# Altium project AM3358_DEV_BOARD.PrjPcb (part 2 of 3)

## Sheet 07. WIFI.SchDoc
size A2
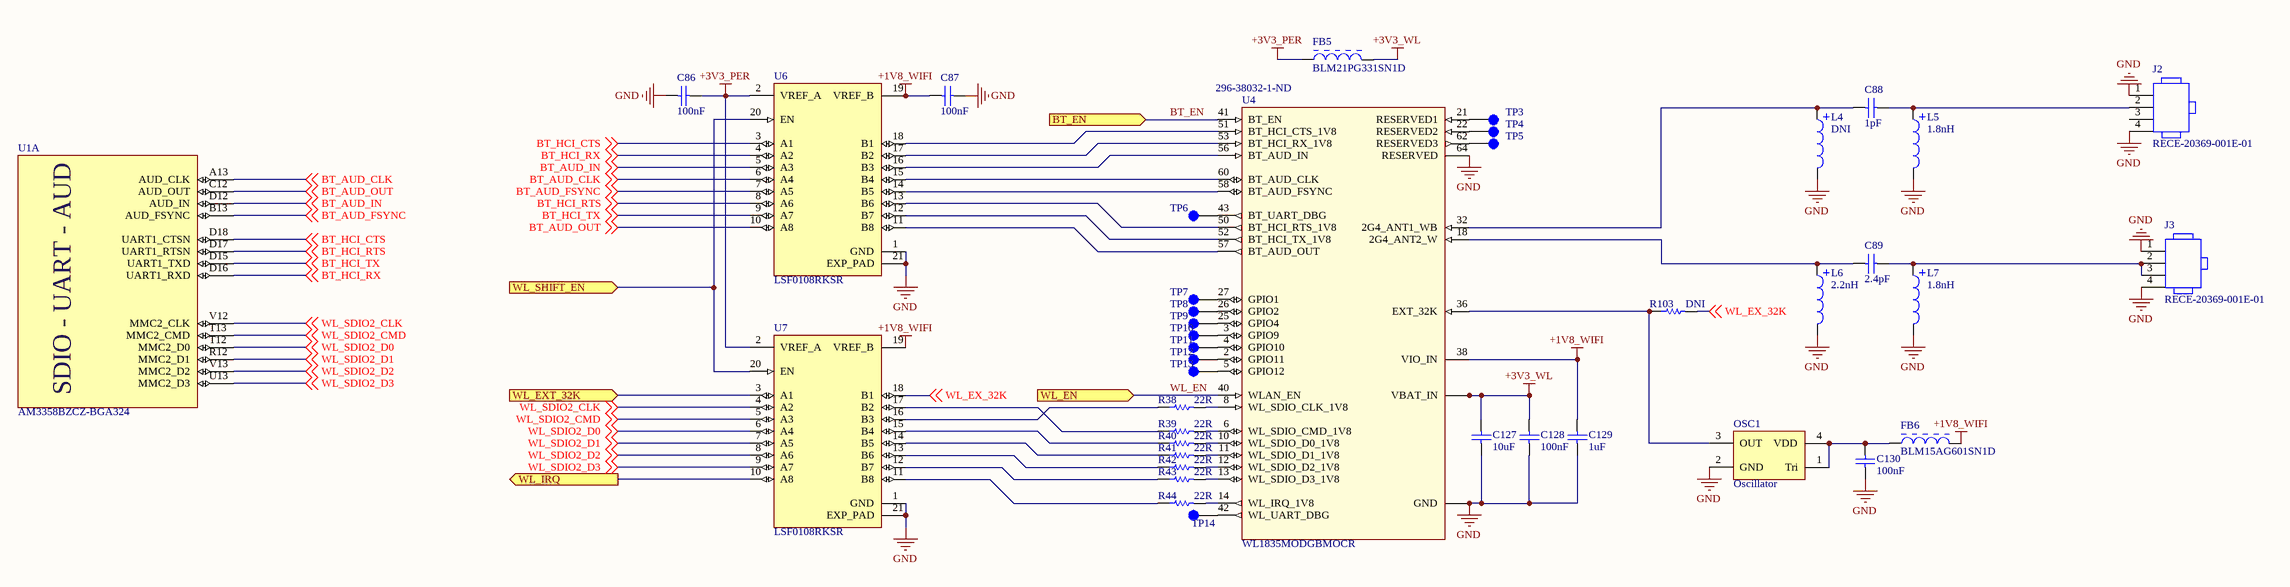
[diagram p4: 07. WIFI.SchDoc]

### Parts
C86  100nF  [CAPC1005X60X30LL05T10]
C87  100nF  [CAPC1005X60X30LL05T10]
C88  1pF  [CAPC1005X60X30LL05T10]
C89  2.4pF  [CAPC1005X60X30LL05T10]
C127  10uF  [CAPC1608X90X35ML10T15]
C128  100nF  [CAPC1005X60X30LL05T10]
C129  1uF  [CAPC0402(1005)60_M]
C130  100nF  [CAPC1005X60X30LL05T10]
FB5  BLM21PG331SN1D  [MURA-BLM21-H1-CHIP-2_V]
FB6  BLM15AG601SN1D  [MURA-BLM15-CHIP-2_V]
J2  RECE-20369-001E-01  [TG-RECE-20369-001E-4_V]
J3  RECE-20369-001E-01  [TG-RECE-20369-001E-4_V]
L4  DNI  [INDC1005X55X25ML5T10]
L5  1.8nH  [INDC1005X55X25ML5T10]
L6  2.2nH  [INDC1005X55X25ML5T10]
L7  1.8nH  [INDC1005X55X25ML5T10]
OSC1  Oscillator  [FP-NX3225SA-MFG]
R38  22R  [RESC1005X40X25LL05T05]
R39  22R  [RESC1005X40X25LL05T05]
R40  22R  [RESC1005X40X25LL05T05]
R41  22R  [RESC1005X40X25LL05T05]
R42  22R  [RESC1005X40X25LL05T05]
R43  22R  [RESC1005X40X25LL05T05]
R44  22R  [RESC1005X40X25LL05T05]
R103  DNI  [RESC1005X40X25LL05T05]
TP3  Test Point  [TP]  (value not drawn)
TP4  Test Point  [TP]  (value not drawn)
TP5  Test Point  [TP]  (value not drawn)
TP6  Test Point  [TP]  (value not drawn)
TP7  Test Point  [TP]  (value not drawn)
TP8  Test Point  [TP]  (value not drawn)
TP9  Test Point  [TP]  (value not drawn)
TP10  Test Point  [TP]  (value not drawn)
TP11  Test Point  [TP]  (value not drawn)
TP12  Test Point  [TP]  (value not drawn)
TP13  Test Point  [TP]  (value not drawn)
TP14  Test Point  [TP]  (value not drawn)
U1  AM3358BZCZ-BGA324  [TI-ZCZ324]  (part A of 11)
U4  WL1835MODGBMOCR  Supplier Part Number 1: 296-38032-1-ND  [WL1835MODGBMOCR]
U6  LSF0108RKSR  [QFN50P450X250X100-21N]
U7  LSF0108RKSR  [QFN50P450X250X100-21N]

### Ports
BT_EN (in), WL_EN (in), WL_EXT_32K (in), WL_IRQ (out), WL_SHIFT_EN (in)

### Nets
+1V8_WIFI: C87.2 C129.1 FB6.2 U4.38(VIO_IN) U6.19(VREF_B) U7.19(VREF_B)
+3V3_PER: C86.2 FB5.1 U6.2(VREF_A) U7.2(VREF_A)
+3V3_WL: C127.2 C128.2 FB5.2 U4.46(VBAT_IN) U4.47(VBAT_IN)
GND: C86.1 C87.1 C127.1 C128.1 C129.2 C130.1 J2.1 J2.4 J3.1 J3.4 L4.2 L5.2 L6.2 L7.2 OSC1.2(GND) U4.1(GND) U4.7(GND) U4.9(GND) U4.15(GND) U4.16(GND) U4.17(GND) U4.19(GND) U4.20(GND) U4.23(GND) U4.24(GND) U4.28(GND) U4.29(GND) U4.30(GND) U4.31(GND) U4.33(GND) U4.34(GND) U4.35(GND) U4.37(GND) U4.39(GND) U4.44(GND) U4.45(GND) U4.48(GND) U4.49(GND) U4.54(GND) U4.55(GND) U4.59(GND) U4.61(GND) U4.63(GND) U4.64(RESERVED) U4.G1(GND) U4.G2(GND) U4.G3(GND) U4.G4(GND) U4.G5(GND) U4.G6(GND) U4.G7(GND) U4.G8(GND) U4.G9(GND) U4.G10(GND) U4.G11(GND) U4.G12(GND) U4.G13(GND) U4.G14(GND) U4.G15(GND) U4.G16(GND) U4.G17(GND) U4.G18(GND) U4.G19(GND) U4.G20(GND) U4.G21(GND) U4.G22(GND) U4.G23(GND) U4.G24(GND) U4.G25(GND) U4.G26(GND) U4.G27(GND) U4.G28(GND) U4.G29(GND) U4.G30(GND) U4.G31(GND) U4.G32(GND) U4.G33(GND) U4.G34(GND) U4.G35(GND) U4.G36(GND) U6.1(GND) U6.21(EXP_PAD) U7.1(GND) U7.21(EXP_PAD)
BT_AUD_CLK: U1.A13(AUD_CLK) U6.6(A4) ; off-sheet BT_AUD_CLK
BT_AUD_FSYNC: U1.B13(AUD_FSYNC) U6.7(A5) ; off-sheet BT_AUD_FSYNC
BT_AUD_IN: U1.D12(AUD_IN) U6.5(A3) ; off-sheet BT_AUD_IN
BT_AUD_OUT: U1.C12(AUD_OUT) U6.10(A8) ; off-sheet BT_AUD_OUT
BT_EN: U4.41(BT_EN) ; port BT_EN
BT_HCI_CTS: U1.D18(UART1_CTSN) U6.3(A1) ; off-sheet BT_HCI_CTS
BT_HCI_RTS: U1.D17(UART1_RTSN) U6.8(A6) ; off-sheet BT_HCI_RTS
BT_HCI_RX: U1.D16(UART1_RXD) U6.4(A2) ; off-sheet BT_HCI_RX
BT_HCI_TX: U1.D15(UART1_TXD) U6.9(A7) ; off-sheet BT_HCI_TX
JTAG_EMU3: U7.3(A1) ; port WL_EXT_32K
WL_EN: U4.40(WLAN_EN) ; port WL_EN
WL_EX_32K: R103.2 U7.18(B1) ; off-sheet WL_EX_32K
WL_SDIO2_CLK: U1.V12(MMC2_CLK) U7.4(A2) ; off-sheet WL_SDIO2_CLK
WL_SDIO2_CMD: U1.T13(MMC2_CMD) U7.5(A3) ; off-sheet WL_SDIO2_CMD
WL_SDIO2_D0: U1.T12(MMC2_D0) U7.6(A4) ; off-sheet WL_SDIO2_D0
WL_SDIO2_D1: U1.R12(MMC2_D1) U7.7(A5) ; off-sheet WL_SDIO2_D1
WL_SDIO2_D2: U1.V13(MMC2_D2) U7.8(A6) ; off-sheet WL_SDIO2_D2
WL_SDIO2_D3: U1.U13(MMC2_D3) U7.9(A7) ; off-sheet WL_SDIO2_D3
NetC88_1: C88.1 L4.1 U4.32(2G4_ANT1_WB)
NetC88_2: C88.2 J2.2 L5.1
NetC89_1: C89.1 L6.1 U4.18(2G4_ANT2_W)
NetC89_2: C89.2 J3.2 J3.3 L7.1
NetC130_2: C130.2 FB6.1 OSC1.1(Tri) OSC1.4(VDD)
NetOSC1_3: OSC1.3(OUT) R103.1 U4.36(EXT_32K)
NetR38_1: R38.1 U7.16(B3)
NetR38_2: R38.2 U4.8(WL_SDIO_CLK_1V8)
NetR39_1: R39.1 U7.17(B2)
NetR39_2: R39.2 U4.6(WL_SDIO_CMD_1V8)
NetR40_1: R40.1 U7.15(B4)
NetR40_2: R40.2 U4.10(WL_SDIO_D0_1V8)
NetR41_1: R41.1 U7.14(B5)
NetR41_2: R41.2 U4.11(WL_SDIO_D1_1V8)
NetR42_1: R42.1 U7.13(B6)
NetR42_2: R42.2 U4.12(WL_SDIO_D2_1V8)
NetR43_1: R43.1 U7.12(B7)
NetR43_2: R43.2 U4.13(WL_SDIO_D3_1V8)
NetR44_1: R44.1 U7.11(B8)
NetR44_2: R44.2 U4.14(WL_IRQ_1V8)
NetTP3_1: TP3.1 U4.21(RESERVED1)
NetTP4_1: TP4.1 U4.22(RESERVED2)
NetTP5_1: TP5.1 U4.62(RESERVED3)
NetTP6_1: TP6.1 U4.43(BT_UART_DBG)
NetTP7_1: TP7.1 U4.27(GPIO1)
NetTP8_1: TP8.1 U4.26(GPIO2)
NetTP9_1: TP9.1 U4.25(GPIO4)
NetTP10_1: TP10.1 U4.3(GPIO9)
NetTP11_1: TP11.1 U4.4(GPIO10)
NetTP12_1: TP12.1 U4.2(GPIO11)
NetTP13_1: TP13.1 U4.5(GPIO12)
NetTP14_1: TP14.1 U4.42(WL_UART_DBG)
NetU1_B12: U7.10(A8) ; port WL_IRQ
NetU1_C13: U6.20(EN) U7.20(EN) ; port WL_SHIFT_EN
NetU4_50: U4.50(BT_HCI_RTS_1V8) U6.13(B6)
NetU4_51: U4.51(BT_HCI_CTS_1V8) U6.18(B1)
NetU4_52: U4.52(BT_HCI_TX_1V8) U6.12(B7)
NetU4_53: U4.53(BT_HCI_RX_1V8) U6.17(B2)
NetU4_56: U4.56(BT_AUD_IN) U6.16(B3)
NetU4_57: U4.57(BT_AUD_OUT) U6.11(B8)
NetU4_58: U4.58(BT_AUD_FSYNC) U6.14(B5)
NetU4_60: U4.60(BT_AUD_CLK) U6.15(B4)

Not connected (* = marked no-connect by the designer): J2 3

### Notes on the sheet
- Title
- Size:
- Date:
- Design by:
- A4
- Number:
- Time:
- Check by:
- Revision:
- Sheet
- of
- N.S.T
- https://github.com/tung080827
- (in symbol AM3358BZCZ100, part A) SDIO - UART - AUD

### Library data of the parts
C86 C87 C128 C130 = CMP-2100-03641-1: as C1 on sheet 03. POWER; REACH SVHC: NoSVHC; Depth: 0.5mm; Case/Package: 0402; Datasheet URL: http://psearch.en.murata.com/capacitor/product/GRM155R71C104KA88%23.pdf; Lead Free: LeadFree; Dielectric Material: Ceramic; Manufacturer URL: http://www.murata.com/; Min Operating Temperature: -55degC; Length: 1mm; Case Code (Metric): 1005; Radiation Hardening: No; Package Reference: 0402; RoHSCompliant: true; Datasheet Version: 42675.0; Thickness: 0.022inch; Packaging: TapeandReel; Voltage Rating (DC): 16V; Tolerance: 10%; Max Operating Temperature: 125degC; Package Description: 2-Pin Surface Mount Device, Body 1 x 0.5 mm; Mount: SurfaceMount; Height: 0.5mm; Width: 0.5mm; Number of Pins: 2; Voltage Rating: 16V; Case Code (Imperial): 0402; Termination: SMD/SMT; Capacitance: 100nF; Package Quantity: 1
C88 = CMP-2008-02599-1: Ceramic; Cap 1 pF; Tol 0.25 pF; Vol-Rtg 50 VDC; SMT; 0402; C0G; Tape & Reel; Part Number: 04025A1R0CAT2A; Manufacturer: AVX Interconnect / Elco
C89 = CMP-1032-00062-1: CAP 2.4pF 16V ±0.25pF 01005 (0402 Metric) Thickness 0.22mm SMD; Tolerance: Â±0.25pF; Case-Metric: 0402; Case-EIA: 01005; Technology: SMT; Value: 2.4pF; Rated Voltage: 16 V; Max Thickness: 0.22 mm
C127 = CMP-2006-02792-1: Chip Capacitor, 10 uF, +/- 10%, 6.3 V, -55 to 125 degC, 0603 (1608 Metric), RoHS, Tape and Reel; Part Number: GRM188R60J106ME47D; Manufacturer: Murata
C129 = CMP-1034-02113-1: CAP 1uF 6.3V ±10% 0402 (1005 Metric) Thickness 0.6mm SMD; Case-Metric: 1005; Case-EIA: 0402; Tolerance: Â±10%; Value: 1uF; Technology: SMT; Rated Voltage: 6.3 V; Max Thickness: 0.6 mm
FB5 = CMP-0686-00713-2: Chip Ferrite Bead for Power Lines, 330 Ohm, 1500 mA, -55 to 125 degC, 2 x 1.25 x 1.05 mm SMD, Tape and Reel; Manufacturer: Murata; Rated Current: 1500 mA; DC Resistance: 0.07 Ohm Max.; Impedance (at 100 MHz): 330 Ohm +/- 25%; Operating Temperature Range: -55 to 125 degC; PartNumber: BLM21PG331SN1D; ComponentLink2URL: http://www.murata.com/products/catalog/pdf/c31e.pdf; PackageDescription: 2-Pin Chip, Body 2 x 1.25 mm; PackageReference: BLM21_H1050-2; ComponentLink1Description: Manufacturer URL; ComponentLink2Description: Datasheet; ComponentLink3Description: Package Specification; ComponentLink3URL: http://www.murata.com/products/catalog/pdf/c31e.pdf; DatasheetVersion: 08/2013; ComponentLink1URL: http://www.murata.com/; Packing: Tape and Reel; Mounting Technology: Surface Mount
FB6 = CMP-0686-00187-3: Chip Ferrite Bead for General Use, 600 Ohm, 300 mA, -55 to 125 degC, 1 x 0.5 x 0.55 mm SMD, Tape and Reel; Manufacturer: Murata; Impedance (at 100 MHz): 600 Ohm +/- 25%; DC Resistance: 0.52 Ohm Max.; Rated Current: 300 mA; PackageDescription: 2-Pin Chip, Body 1 x 0.5 mm; Mounting Technology: Surface Mount; ComponentLink1Description: Manufacturer URL; ComponentLink3Description: Package Specification; ComponentLink2Description: Datasheet; Operating Temperature Range: -55 to 125 degC; Packing: Tape and Reel; ComponentLink1URL: http://www.murata.com/; PackageReference: BLM15-2; DatasheetVersion: 08/2013; PartNumber: BLM15AG601SN1D; ComponentLink3URL: http://www.murata.com/products/catalog/pdf/c31e.pdf; ComponentLink2URL: http://www.murata.com/products/catalog/pdf/c31e.pdf
J2 J3 = CMP-0275-00001-2: RF Connector, Onboard Receptacle, IPEX MHFIII; Manufacturer: Taoglas; Packing: Tape and Reel; Mounting Technology: Surface Mount; PackageReference: RECE-20369-001E-01-4; ComponentLink1URL: http://www.taoglas.com/; Housing Color: Gold; DatasheetVersion: Rev. C; ComponentLink2URL: http://www.taoglas.com/images/product_images/original_images/RECE.20369.001E.01.pdf; ComponentLink3Description: Package Specification; PackageVersion: Rev. C; ComponentLink1Description: Manufacturer URL; ComponentLink2Description: Datasheet; PackageDescription: 4-Pin, Hand Drawn, Body 1.7x1.7mm; ComponentLink3URL: http://www.taoglas.com/images/product_images/original_images/RECE.20369.001E.01.pdf; PartNumber: RECE-20369-001E-01
L4 L5 L7 = CMP-1662-00024-1: Chip Inductor, 1.8 nH, +/- 0.3 nH, 300 mA, -55 to 125 degC, 0402 (1005 Metric), RoHS, Tape and Reel; Voltage Rating: 50 V; Case\Package: 0603; Power Rating: 100 mW; Resistance: 47 Ohm; Tolerance: 1%; PackageDescription: 2-Pin Surface Mount Device, Body 1 x 0.5 mm; ComponentLink1Description: Manufacturer URL; Length: 1.6 mm; Case Code (Imperial): 0603; REACH SVHC: No SVHC; Case Code (Metric): 1608; ComponentLink1URL: http://www.murata.com/; DatasheetVersion: Sep-10; Height: 0.45 mm; ComponentLink2URL: http://search.murata.co.jp/Ceramy/image/img/PDF/ENG/L0075S0083LQG15HN.pdf; Packaging: Tape and Reel; PackageReference: 0402; Min Operating Temperature: -55 degC; Mount: Surface Mount; Package Quantity: 5000; Width: 0.8 mm; RoHSCompliant: true; Voltage Rating (DC): 50 V; Pins: 2; ComponentLink2Description: Datasheet; Max Operating Temperature: 155 degC
L6 = CMP-1662-00024-1: Chip Inductor, 2.2 nH, +/- 0.3 nH, 300 mA, -55 to 125 degC, 0402 (1005 Metric), RoHS, Tape and Reel; Voltage Rating: 50 V; Case\Package: 0603; Power Rating: 100 mW; Resistance: 47 Ohm; Tolerance: 1%; PackageDescription: 2-Pin Surface Mount Device, Body 1 x 0.5 mm; ComponentLink1Description: Manufacturer URL; Length: 1.6 mm; Case Code (Imperial): 0603; REACH SVHC: No SVHC; Case Code (Metric): 1608; ComponentLink1URL: http://www.murata.com/; DatasheetVersion: Sep-10; Height: 0.45 mm; ComponentLink2URL: http://search.murata.co.jp/Ceramy/image/img/PDF/ENG/L0075S0083LQG15HN.pdf; Packaging: Tape and Reel; PackageReference: 0402; Min Operating Temperature: -55 degC; Mount: Surface Mount; Package Quantity: 5000; Width: 0.8 mm; RoHSCompliant: true; Voltage Rating (DC): 50 V; Pins: 2; ComponentLink2Description: Datasheet; Max Operating Temperature: 155 degC
R38-R44 R103 = CMP-1665-00027-3: as R77 on sheet 05. LCD; ComponentLink2Description: Datasheet; Packaging: Tape and Reel; Weight: 2.8E-05oz; Pins: 2; Case Code (Imperial): 0402; Width: 0.5 mm; ComponentLink2URL: http://industrial.panasonic.com/cdbs/www-data/pdf/RDA0000/AOA0000C86.pdf; Height: 0.35 mm; PackageReference: 0402; REACH SVHC: Yes; Min Operating Temperature: -55 degC; Length: 1 mm; DatasheetVersion: 04/2015; RoHSCompliant: true; Package Quantity: 10000; Case Code (Metric): 1005; PackageDescription: 2-Pin Surface Mount Device, Body 1 x 0.5 mm; ComponentLink1URL: http://www.panasonic.com/; Mount: Surface Mount; Mounting Technology: Surface Mount; Tolerance: 1%; Max Operating Temperature: 155 degC; ComponentLink1Description: Manufacturer URL
TP3-TP14 = TP
U1 = AM3358BZCZ100: as U1 on sheet 03. POWER; Supplier 1: Digi-Key
U4 = WL1835MOD: Bluetooth, WiFi 802.11b/g/n, Bluetooth 4.2 Transceiver Module 2.4GHz Surface Mount; Supplier 1: Digi-Key
U6 U7 = LSF0108: Voltage Level Translator Bidirectional 1 Circuit 8 Channel 20-VQFN _4.5x2.5_; MF: Texas Instruments; Value: *; MP: LSF0108RKSR; Package: VQFN-20 Texas Instruments; Price: None; Availability: Unavailable; SnapEDA_Link: https://www.snapeda.com/parts/LSF0108RKSR/Texas%20Instruments/view-part/190982/?ref=snap
OSC1 = Oscillator: Supplier 1: Digi-Key

## Sheet 09. SDIO, PERIPHERAL.SchDoc
size A3
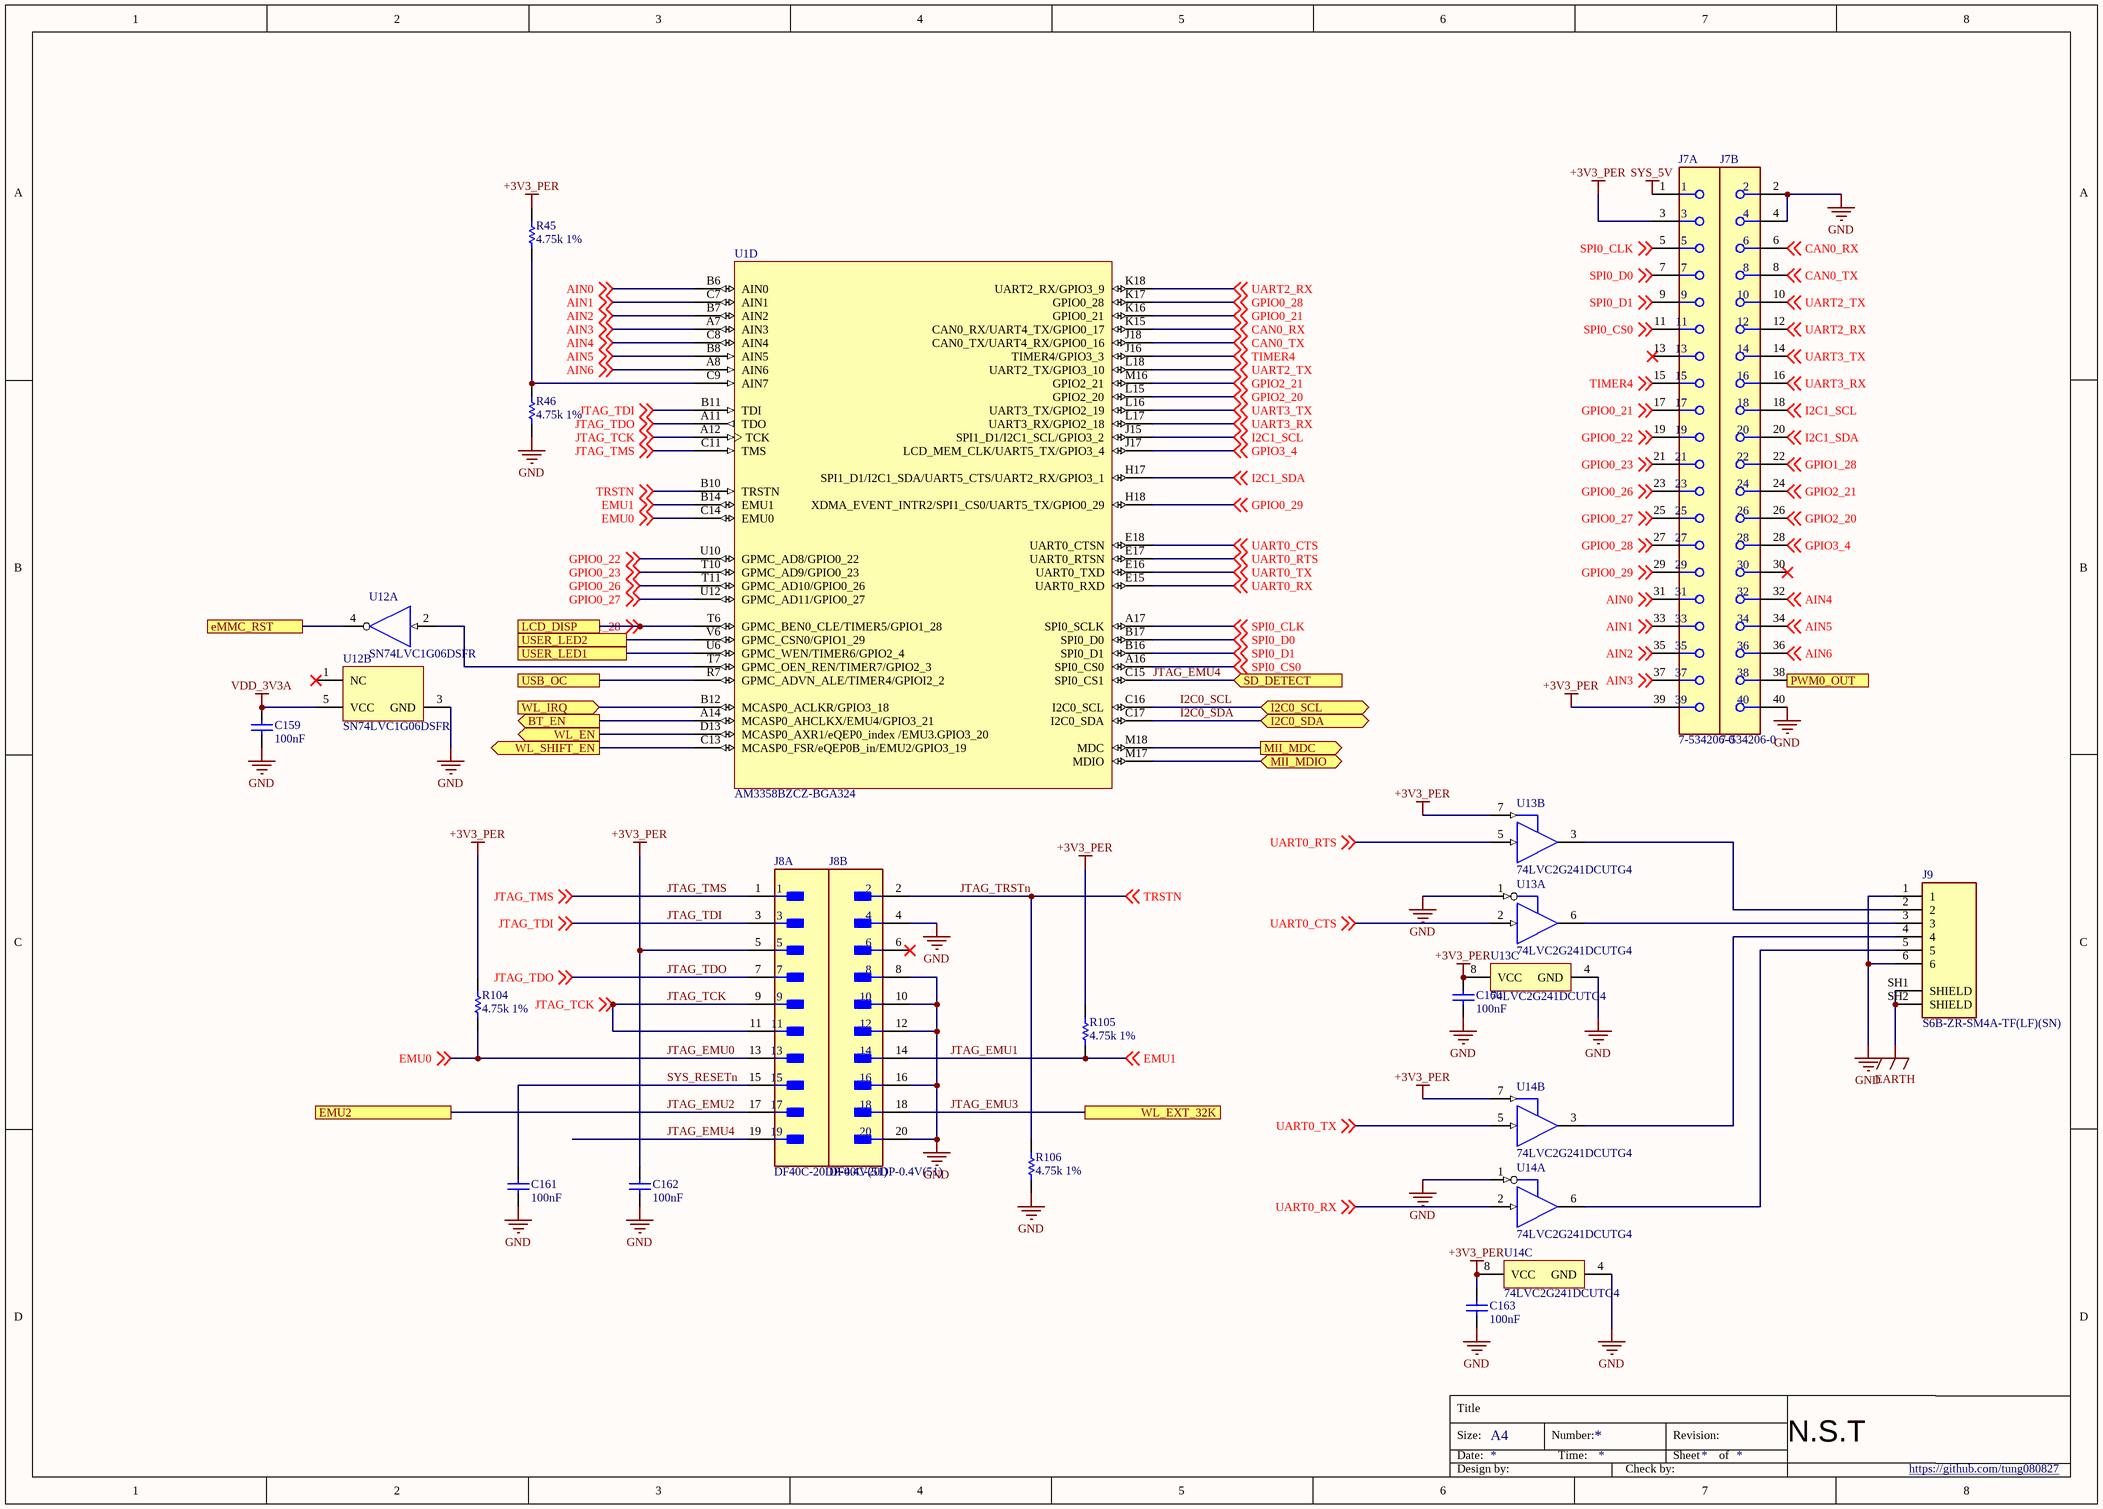
[diagram p5: 09. SDIO, PERIPHERAL.SchDoc]

### Parts
C159  100nF  [CAPC1005X55X25LL05T10]
C160  100nF  [CAPC1005X55X25LL05T10]
C161  100nF  [CAPC1005X55X25LL05T10]
C162  100nF  [CAPC1005X55X25LL05T10]
C163  100nF  [CAPC1005X55X25LL05T10]
J7  7-534206-0  [FP-7-534206-0-MFG]  (parts A,B of 2)
J8  DF40C-20DP-0.4V(51)  [FP-DF40C-20DP-0_4V_51-MFG]  (parts A,B of 3)
J9  S6B-ZR-SM4A-TF(LF)(SN)  [JST_S6B-ZR-SM4A-TF]
R45  4.75k 1%  [RESC1005X40X25LL05T05]
R46  4.75k 1%  [RESC1005X40X25LL05T05]
R104  4.75k 1%  [RESC1005X40X25LL05T05]
R105  4.75k 1%  [RESC1005X40X25LL05T05]
R106  4.75k 1%  [RESC1005X40X25LL05T05]
U1  AM3358BZCZ-BGA324  [TI-ZCZ324]  (part D of 11)
U12  SN74LVC1G06DSFR  [DSF0006A_V]  (parts A,B of 2)
U13  74LVC2G241DCUTG4  [DCU0008A_M]  (parts A,B,C of 3)
U14  74LVC2G241DCUTG4  [DCU0008A_M]  (parts A,B,C of 3)

### Ports
BT_EN (out), eMMC_RST, EMU2, I2C0_SCL (bidir), I2C0_SDA (bidir), LCD_DISP, MII_MDC (out), MII_MDIO (bidir), PWM0_OUT, SD_DETECT (in), USB_OC, USER_LED1, USER_LED2, WL_EN (out), WL_EXT_32K, WL_IRQ (in), WL_SHIFT_EN (out)

### Nets
+3V3_PER: C160.2 C162.2 C163.2 J7.3 J7.39 J8.5 R45.2 R104.2 R105.2 U13.7(2OE) U13.8(VCC) U14.7(2OE) U14.8(VCC)
EARTH: J9.SH1(SHIELD) J9.SH2(SHIELD)
GND: C159.1 C160.1 C161.1 C162.1 C163.1 J7.2 J7.4 J7.40 J8.4 J8.8 J8.10 J8.12 J8.16 J8.20 J9.1 J9.6 R46.1 R106.1 U12.3(GND) U13.1(1~{OE}) U13.4(GND) U14.1(1~{OE}) U14.4(GND)
SYS_5V: J7.1
VDD_3V3A: C159.2 U12.5(VCC)
AIN0: J7.31 U1.B6(AIN0) ; off-sheet AIN0
AIN1: J7.33 U1.C7(AIN1) ; off-sheet AIN1
AIN2: J7.35 U1.B7(AIN2) ; off-sheet AIN2
AIN3: J7.37 U1.A7(AIN3) ; off-sheet AIN3
AIN4: J7.32 U1.C8(AIN4) ; off-sheet AIN4
AIN5: J7.34 U1.B8(AIN5) ; off-sheet AIN5
AIN6: J7.36 U1.A8(AIN6) ; off-sheet AIN6
BT_EN: U1.A14(MCASP0_AHCLKX/EMU4/GPIO3_21) ; port BT_EN
CAN0_RX: J7.6 U1.K15(CAN0_RX/UART4_TX/GPIO0_17) ; off-sheet CAN0_RX
CAN0_TX: J7.8 U1.J18(CAN0_TX/UART4_RX/GPIO0_16) ; off-sheet CAN0_TX
GPIO0_21: J7.17 U1.K16(GPIO0_21) ; off-sheet GPIO0_21
GPIO0_22: J7.19 U1.U10(GPMC_AD8/GPIO0_22) ; off-sheet GPIO0_22
GPIO0_23: J7.21 U1.T10(GPMC_AD9/GPIO0_23) ; off-sheet GPIO0_23
GPIO0_26: J7.23 U1.T11(GPMC_AD10/GPIO0_26) ; off-sheet GPIO0_26
GPIO0_27: J7.25 U1.U12(GPMC_AD11/GPIO0_27) ; off-sheet GPIO0_27
GPIO0_28: J7.27 U1.K17(GPIO0_28) ; off-sheet GPIO0_28
GPIO0_29: J7.29 U1.H18(XDMA_EVENT_INTR2/SPI1_CS0/UART5_TX/GPIO0_29) ; off-sheet GPIO0_29
GPIO1_28: J7.22 U1.T6(GPMC_BEN0_CLE/TIMER5/GPIO1_28) ; off-sheet GPIO1_28, port LCD_DISP
GPIO2_20: J7.26 U1.L15(GPIO2_20) ; off-sheet GPIO2_20
GPIO2_21: J7.24 U1.M16(GPIO2_21) ; off-sheet GPIO2_21
GPIO3_4: J7.28 U1.J17(LCD_MEM_CLK/UART5_TX/GPIO3_4) ; off-sheet GPIO3_4
I2C0_SCL: U1.C16(I2C0_SCL) ; port I2C0_SCL
I2C0_SDA: U1.C17(I2C0_SDA) ; port I2C0_SDA
I2C1_SCL: J7.18 U1.J15(SPI1_D1/I2C1_SCL/GPIO3_2) ; off-sheet I2C1_SCL
I2C1_SDA: J7.20 U1.H17(SPI1_D1/I2C1_SDA/UART5_CTS/UART2_RX/GPIO3_1) ; off-sheet I2C1_SDA
JTAG_EMU0: J8.13 R104.1 U1.C14(EMU0) ; off-sheet EMU0  [also labelled EMU0]
JTAG_EMU1: J8.14 R105.1 U1.B14(EMU1) ; off-sheet EMU1  [also labelled EMU1]
JTAG_EMU2: J8.17 ; port EMU2
JTAG_EMU3: J8.18 ; port WL_EXT_32K
JTAG_EMU4: J8.19 U1.C15(SPI0_CS1) ; port SD_DETECT
JTAG_TCK: J8.9 J8.11 U1.A12(TCK) ; off-sheet JTAG_TCK
JTAG_TDI: J8.3 U1.B11(TDI) ; off-sheet JTAG_TDI
JTAG_TDO: J8.7 U1.A11(TDO) ; off-sheet JTAG_TDO
JTAG_TMS: J8.1 U1.C11(TMS) ; off-sheet JTAG_TMS
JTAG_TRSTn: J8.2 R106.2 U1.B10(TRSTN) ; off-sheet TRSTN  [also labelled TRSTN]
SPI0_CLK: J7.5 U1.A17(SPI0_SCLK) ; off-sheet SPI0_CLK
SPI0_CS0: J7.11 U1.A16(SPI0_CS0) ; off-sheet SPI0_CS0
SPI0_D0: J7.7 U1.B17(SPI0_D0) ; off-sheet SPI0_D0
SPI0_D1: J7.9 U1.B16(SPI0_D1) ; off-sheet SPI0_D1
SYS_RESETn: C161.2 J8.15
TIMER4: J7.15 U1.J16(TIMER4/GPIO3_3) ; off-sheet TIMER4
UART0_CTS: U1.E18(UART0_CTSN) U13.2(1A) ; off-sheet UART0_CTS
UART0_RTS: U1.E17(UART0_RTSN) U13.5(2A) ; off-sheet UART0_RTS
UART0_RX: U1.E15(UART0_RXD) U14.2(1A) ; off-sheet UART0_RX
UART0_TX: U1.E16(UART0_TXD) U14.5(2A) ; off-sheet UART0_TX
UART2_RX: J7.12 U1.K18(UART2_RX/GPIO3_9) ; off-sheet UART2_RX
UART2_TX: J7.10 U1.L18(UART2_TX/GPIO3_10) ; off-sheet UART2_TX
UART3_RX: J7.16 U1.L17(UART3_RX/GPIO2_18) ; off-sheet UART3_RX
UART3_TX: J7.14 U1.L16(UART3_TX/GPIO2_19) ; off-sheet UART3_TX
WL_EN: U1.D13(MCASP0_AXR1/eQEP0_index_/EMU3.GPIO3_20) ; port WL_EN
NetJ7_38: J7.38 ; port PWM0_OUT
NetJ9_2: J9.2 U13.3(2Y)
NetJ9_3: J9.3 U13.6(1Y)
NetJ9_4: J9.4 U14.3(2Y)
NetJ9_5: J9.5 U14.6(1Y)
NetR36_2: U1.M17(MDIO) ; port MII_MDIO
NetR45_1: R45.1 R46.2 U1.C9(AIN7)
NetR62_1: U12.4(Y) ; port eMMC_RST
NetR107_1: U1.R7(GPMC_ADVN_ALE/TIMER4/GPIOI2_2) ; port USB_OC
NetU1_B12: U1.B12(MCASP0_ACLKR/GPIO3_18) ; port WL_IRQ
NetU1_C13: U1.C13(MCASP0_FSR/eQEP0B_in/EMU2/GPIO3_19) ; port WL_SHIFT_EN
NetU1_M18: U1.M18(MDC) ; port MII_MDC
NetU1_T7: U1.T7(GPMC_OEN_REN/TIMER7/GPIO2_3) U12.2(A)
NetU1_U6: U1.U6(GPMC_WEN/TIMER6/GPIO2_4) ; port USER_LED1
NetU1_V6: U1.V6(GPMC_CSN0/GPIO1_29) ; port USER_LED2

Not connected (* = marked no-connect by the designer): J7 13* 30*; J8 6*; U12 1(NC)*

### Notes on the sheet
- Title
- Size:
- Date:
- A4
- Number:
- Time:
- Revision:
- Sheet
- of
- N.S.T
- Design by:
- Check by:
- https://github.com/tung080827

### Library data of the parts
C159-C163 = CMP-2100-03641-1: as C1 on sheet 03. POWER; REACH SVHC: NoSVHC; Depth: 0.5mm; Case/Package: 0402; Datasheet URL: http://psearch.en.murata.com/capacitor/product/GRM155R71C104KA88%23.pdf; Lead Free: LeadFree; Dielectric Material: Ceramic; Manufacturer URL: http://www.murata.com/; Min Operating Temperature: -55degC; Length: 1mm; Case Code (Metric): 1005; Radiation Hardening: No; Package Reference: 0402; RoHSCompliant: true; Datasheet Version: 42675.0; Thickness: 0.022inch; Packaging: TapeandReel; Voltage Rating (DC): 16V; Tolerance: 10%; Max Operating Temperature: 125degC; Package Description: 2-Pin Surface Mount Device, Body 1 x 0.5 mm; Mount: SurfaceMount; Height: 0.5mm; Width: 0.5mm; Number of Pins: 2; Voltage Rating: 16V; Case Code (Imperial): 0402; Termination: SMD/SMT; Capacitance: 100nF; Package Quantity: 1
J7 = CMP-03369-000068-1: CONN RCPT 40POS 0.1 GOLD PCB; Manufacturer: TE Connectivity; Standoff Height: 0.38mm; Voltage Rating: 333V; Conn Orientation: Vertical; Is Female: yes; Pitch: 2.54mm; Number Of Contacts: 40; Current Rating: 2A; Conn Gender: Female; Temperature: -65°C to +105°C; Temperature Range High: +105°C; Temperature Range Low: -65°C; Package: 7-534206-0; Lead Free: Yes; Manufacturer Part Number: 7-534206-0; Contact Material: Gold,Nickel; Device Class L2: Headers and Wire Housings; RoHS: TRUE; Number Of Rows: 2; Octopart: https://octopart.com/7-534206-0-te+connectivity-39516831; Device Class L3: unset; Device Class L1: Connectors; Mouser Description: Headers & Wire Housings REC 2X20P VRT T/H; ComponentLink2URL: https://octopart.com/datasheet/7-534206-0-te+connectivity-39516831; ComponentLink2Description: Datasheet; Digikey Description: CONN RCPT 40POS 0.1 GOLD PCB; Footprint Url: https://www.mouser.in/datasheet/2/418/NG_CD_534206_R7-1252933.pdf; Category: Conn; Height: 8.9mm; Automotive: No
J8 = CMP-11605-000001-1: CONN PLUG 20POS SMD GOLD; Manufacturer: Hirose; Conn Orientation: Straight; Conn Gender: Male; Standoff Height: 0mm; Current Rating: 0.3A; Voltage Rating: 30V; Number Of Contacts: 20; Pitch: 0.4mm; Number Of Rows: 2; Automotive: No; Manufacturer Part Number: DF40C-20DP-0.4V(51); Category: Conn; Footprint Url: https://www.hirose.com/product/document?clcode=CL0684-4010-9-51&productname=DF40C-20DP-0.4V(51)&series=DF40&documenttype=2DDrawing&lang=en&documentid=0001001212; Temperature: -35°C to +85°C; Temperature Range Low: -35°C; RoHS: TRUE; Height: 1.29mm; Device Class L3: unset; Lead Free: Yes; ComponentLink2Description: Datasheet; ComponentLink2URL: https://www.hirose.com/product/document?clcode=CL0684-4010-9-51&productname=DF40C-20DP-0.4V(51)&series=DF40&documenttype=SpecSheet&lang=en&documentid=0000427721; Temperature Range High: +85°C; Octopart: https://octopart.com/df40c-20dp-0.4v%2851%29-hirose-11540400; Package: 0; Contact Material: Gold,Nickel; Digikey Description: CONN PLUG 20POS SMD GOLD; Device Class L1: Connectors; Device Class L2: Board to Board Connectors
J9 = S6B-ZR-SM4A-TF(LF)(SN): Connector Header Surface Mount, Right Angle 6 position 0.059 _1.50mm_; MP: S6B-ZR-SM4A-TF_LF__SN_; MF: JST Sales; Digi-Key_Purchase_URL: https://www.digikey.com/product-detail/en/jst-sales-america-inc/S6B-ZR-SM4A-TF_LF__SN_/455-1610-1-ND/858041?utm_source=snapeda&utm_medium=aggregator&utm_campaign=symbol; Package: None; Digi-Key_Part_Number: 455-1610-1-ND; Value: *; SnapEDA_Link: https://www.snapeda.com/parts/S6B-ZR-SM4A-TF%28LF%29%28SN%29/JST%20Sales%20America%20Inc./view-part/641277/?ref=snap
R45 R46 R104-R106 = CMP-2002-00054-1: Manufacturer: Vishay Dale; Part Number: CRCW04024K75FKED
U1 = AM3358BZCZ100: as U1 on sheet 03. POWER; Supplier 1: Digi-Key
U12 = CMP-0859-00956-3: Single Inverter Buffer/Driver With Open-Drain Output, DSF0006A, LARGE T&R; Manufacturer: Texas Instruments; Voltage(Nom)(V): 1.8,2.5,3.3,5; Technology Family: LVC; Logic: Inverting; ICC @ Nom Voltage(Max)(mA): 0.01; VCC(Max)(V): 5.5; Output Drive (IOL/IOH)(Max)(mA): 32/-32; Bits(#): 1; 3-State Output: No; Input Type: CMOS/TTL; Sub-Family: Inverting Buffer/Driver; F @ Nom Voltage(Max)(Mhz): 150; Output Type: CMOS; tpd @ Nom Voltage(Max)(ns): 6.5,4,3; Rating: Catalog; VCC(Min)(V): 1.65; Generic Part Number: SN74LVC1G06; Schmitt Trigger: No; DatasheetVersion: SCES295W; Operating Temperature Range(C): -40 to 125,-40 to 85; PackageReference: DSF0006A
U13 U14 = CMP-0859-00582-3: Dual Buffer/Driver With 3-State Outputs, DCU0008A, SMALL T&R; Manufacturer: Texas Instruments; Generic Part Number: SN74LVC2G241; 3-State Output: Yes; tpd @ Nom Voltage(Max)(ns): 8.8,4.8,4.3,3.7; Voltage(Nom)(V): 1.8,2.5,3.3,5; Schmitt Trigger: No; Input Type: CMOS/TTL; F @ Nom Voltage(Max)(Mhz): 150; Bits(#): 2; ICC @ Nom Voltage(Max)(mA): 0.01; Logic: True; VCC(Min)(V): 1.65; Rating: Catalog; VCC(Max)(V): 5.5; Output Type: CMOS; Output Drive (IOL/IOH)(Max)(mA): 32/-32; Sub-Family: Non-Inverting Buffer/Driver; Technology Family: LVC; PackageReference: DCU0008A; DatasheetVersion: SCES210N; Operating Temperature Range(C): -40 to 125

## Sheet 08. PMIC.SchDoc
size A3
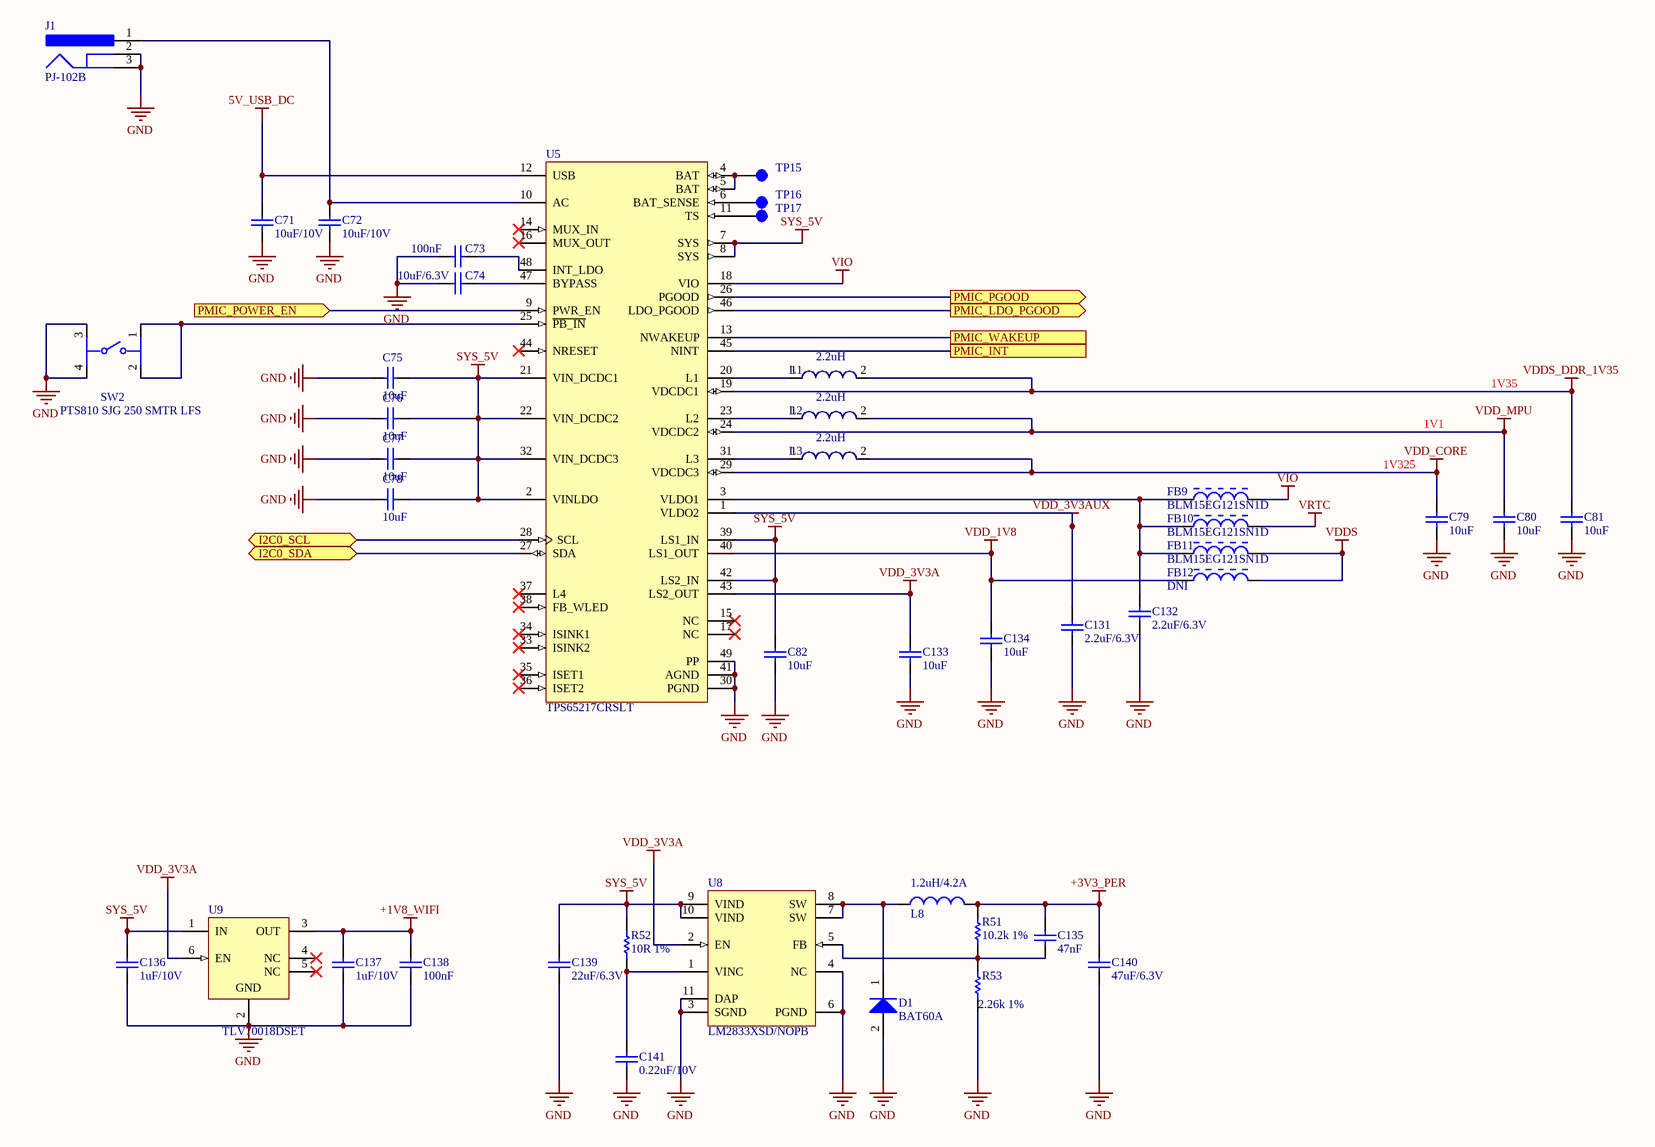
[diagram p6: 08. PMIC.SchDoc]

### Parts
C71  10uF/10V  [CAPC3225X220X30LL30]
C72  10uF/10V  [CAPC3225X220X30LL30]
C73  100nF  [CAPC1005X55X25ML05T10]
C74  10uF/6.3V  [CAPC1608X90X35NL10T15]
C75  10uF  [CAPC2013X140X45NL15T25]
C76  10uF  [CAPC2013X140X45NL15T25]
C77  10uF  [CAPC2013X140X45NL15T25]
C78  10uF  [CAPC2013X140X45NL15T25]
C79  10uF  [CAPC1608X90X35ML10T15]
C80  10uF  [CAPC1608X90X35ML10T15]
C81  10uF  [CAPC1608X90X35ML10T15]
C82  10uF  [CAPC2013X140X45NL15T25]
C131  2.2uF/6.3V  [CAPC1005X60X30LL05T10]
C132  2.2uF/6.3V  [CAPC1005X60X30LL05T10]
C133  10uF  [CAPC1608X90X35ML10T15]
C134  10uF  [CAPC1608X90X35ML10T15]
C135  47nF  [CAPC1005X60X30NL05T10]
C136  1uF/10V  [CAPC1005X55X25NL05T10]
C137  1uF/10V  [CAPC1005X55X25NL05T10]
C138  100nF  [CAPC1005X55X25ML05T10]
C139  22uF/6.3V  [CAPC2013X140X45NL15T25]
C140  47uF/6.3V  [CAPC2013X145X30ML20]
C141  0.22uF/10V  [CAPC1005X55X25NL05T10]
D1  BAT60A  [INF-SOD323_V]
FB9  BLM15EG121SN1D  [MURA-BLM15-CHIP-2_V]
FB10  BLM15EG121SN1D  [MURA-BLM15-CHIP-2_V]
FB11  BLM15EG121SN1D  [MURA-BLM15-CHIP-2_V]
FB12  DNI  [MURA-BLM15-CHIP-2_V]
J1  PJ-102B  [CUI-PJ-102B_V]
L1  2.2uH  [WE-LQS 3015]
L2  2.2uH  [WE-LQS 3015]
L3  2.2uH  [WE-LQS 3015]
L8  1.2uH/4.2A  [LTF5022T-1R2N4R2-LC]
R51  10.2k 1%  [RESC1005X40X25NL05T10]
R52  10R 1%  [RESC1005X40X25ML05T10]
R53  2.26k 1%  [RESC1005X35X25NL10T10]
SW2  PTS810 SJG 250 SMTR LFS  [FP-PTS810_SJG_250_SMTR_LF-MFG]
TP15  Test Point  [TP]  (value not drawn)
TP16  Test Point  [TP]  (value not drawn)
TP17  Test Point  [TP]  (value not drawn)
U5  TPS65217CRSLT  [RSL0048A]
U8  LM2833XSD/NOPB  [DSC0010A_V]
U9  TLV70018DSET  [DSE0006A_V]

### Ports
I2C0_SCL (bidir), I2C0_SDA (bidir), PMIC_INT, PMIC_LDO_PGOOD (out), PMIC_PGOOD (out), PMIC_POWER_EN (in), PMIC_WAKEUP

### Nets
5V_USB_DC: C71.2 U5.12(USB)
+1V8_WIFI: C137.2 C138.2 U9.3(OUT)
+3V3_PER: C135.2 C140.2 L8.2 R51.2
GND: C71.1 C72.1 C73.1 C74.1 C75.2 C76.2 C77.2 C78.2 C79.1 C80.1 C81.1 C82.1 C131.1 C132.1 C133.1 C134.1 C136.1 C137.1 C138.1 C139.1 C140.1 C141.1 D1.2(A) J1.2 J1.3 R53.1 SW2.3 SW2.4 U5.30(PGND) U5.41(AGND) U5.49(PP) U8.3(SGND) U8.4(NC) U8.6(PGND) U8.11(DAP) U9.2(GND)
SYS_5V: C75.1 C76.1 C77.1 C78.1 C82.2 C136.2 C139.2 R52.2 U5.2(VINLDO) U5.7(SYS) U5.8(SYS) U5.21(VIN_DCDC1) U5.22(VIN_DCDC2) U5.32(VIN_DCDC3) U5.39(LS1_IN) U5.42(LS2_IN) U8.9(VIND) U8.10(VIND) U9.1(IN)
VDD_1V8: C134.2 FB12.1 U5.40(LS1_OUT)
VDD_3V3A: C133.2 U5.43(LS2_OUT) U8.2(EN) U9.6(EN)
VDD_3V3AUX: C131.2 U5.1(VLDO2)
VDD_CORE: C79.2 L3.2 U5.29(VDCDC3)
VDD_MPU: C80.2 L2.2 U5.24(VDCDC2)
VDDS: FB11.2 FB12.2
VDDS_DDR_1V35: C81.2 L1.2 U5.19(VDCDC1)
VIO: FB9.2 U5.18(VIO)
VRTC: FB10.2
I2C0_SCL: U5.28(SCL) ; port I2C0_SCL
I2C0_SDA: U5.27(SDA) ; port I2C0_SDA
NetC72_2: C72.2 J1.1 U5.10(AC)
NetC73_2: C73.2 U5.48(INT_LDO)
NetC74_2: C74.2 U5.47(BYPASS)
NetC132_2: C132.2 FB9.1 FB10.1 FB11.1 U5.3(VLDO1)
NetC135_1: C135.1 R51.1 R53.2 U8.5(FB)
NetC141_2: C141.2 R52.1 U8.1(VINC)
NetD1_1: D1.1(K) L8.1 U8.7(SW) U8.8(SW)
NetL1_1: L1.1 U5.20(L1)
NetL2_1: L2.1 U5.23(L2)
NetL3_1: L3.1 U5.31(L3)
NetR4_2: U5.13(NWAKEUP) ; port PMIC_WAKEUP
NetSW2_1: SW2.1 SW2.2 U5.25(~{PB_IN})
NetTP15_1: TP15.1 U5.4(BAT) U5.5(BAT)
NetTP16_1: TP16.1 U5.6(BAT_SENSE)
NetTP17_1: TP17.1 U5.11(TS)
NetU1_B5: U5.46(LDO_PGOOD) ; port PMIC_LDO_PGOOD
NetU1_B15: U5.26(PGOOD) ; port PMIC_PGOOD
NetU1_B18: U5.45(NINT) ; port PMIC_INT
NetU1_C6: U5.9(PWR_EN) ; port PMIC_POWER_EN

Not connected (* = marked no-connect by the designer): U5 14(MUX_IN)* 15(NC)* 16(MUX_OUT)* 17(NC)* 33(ISINK2)* 34(ISINK1)* 35(ISET1)* 36(ISET2)* 37(L4)* 38(FB_WLED)* 44(NRESET)*; U9 4(NC)* 5(NC)*

### Notes on the sheet
- 1V35
- (near C79) 1V325
- 1V1
- Title
- Size:
- Date:
- A4
- Number:
- Time:
- Revision:
- Sheet
- of
- N.S.T
- Design by:
- Check by:
- https://github.com/tung080827

### Library data of the parts
C71 C72 = CMP-2000-06359-1: Chip Capacitor, 10 uF, +/- 10%, 25 V, -55 to 125 degC, 1210 (3225 Metric), RoHS, Tape and Reel; Manufacturer: Murata; Construction form: 1210; Ceramic type: X7R; Capacitance: 10µF; Rated voltage: 25VDC; Package Reference: 1210; Datasheet Version: 03/2016; Package Description: 2-Pin Surface Mount Device, Body 3.2 x 2.5 mm; Mounting Technology: SurfaceMount; Manufacturer URL: http://www.murata.com/; Capacitance tolerance: ±10%; Datasheet URL: http://search.murata.co.jp/Ceramy/image/img/A01X/G101/ENG/GRM32DR71E106KA12-01.pdf
C73 C138 = CMP-2100-03641-1: Chip Capacitor, 0.1 uF, +/- 10%, 16 V, -55 to 125 degC, 0402 (1005 Metric), RoHS, Tape and Reel; Manufacturer: Murata; Material: Ceramic; Insulation Resistance: 10GR; Voltage: 16V; Dielectric: X7R; REACH SVHC: NoSVHC; Depth: 0.5mm; Case/Package: 0402; Datasheet URL: http://psearch.en.murata.com/capacitor/product/GRM155R71C104KA88%23.pdf; Lead Free: LeadFree; Dielectric Material: Ceramic; Manufacturer URL: http://www.murata.com/; Min Operating Temperature: -55degC; Length: 1mm; Case Code (Metric): 1005; Radiation Hardening: No; Package Reference: 0402; RoHSCompliant: true; Datasheet Version: 42675.0; Thickness: 0.022inch; Packaging: TapeandReel; Voltage Rating (DC): 16V; Tolerance: 10%; Max Operating Temperature: 125degC; Package Description: 2-Pin Surface Mount Device, Body 1 x 0.5 mm; Mount: SurfaceMount; Height: 0.5mm; Width: 0.5mm; Number of Pins: 2; Voltage Rating: 16V; Case Code (Imperial): 0402; Termination: SMD/SMT; Capacitance: 100nF; Package Quantity: 1
C74 = CMP-2006-02792-1: Part Number: GRM188R60J106ME47D; Manufacturer: Murata
C75-C78 = CMP-2007-03453-1: Chip Capacitor, 10 uF, +/- 10%, 16 V, -55 to 125 degC, 0805 (1608 Metric), RoHS, Tape and Reel; Manufacturer: Murata; Part Number: GRM21BR61C106KE15L
C79-C81 C133 C134 = CMP-2006-02792-1: Chip Capacitor, 10 uF, +/- 10%, 6.3 V, -55 to 125 degC, 0603 (1608 Metric), RoHS, Tape and Reel; Part Number: GRM188R60J106ME47D; Manufacturer: Murata
C82 = CMP-2007-03453-1: Chip Capacitor, 10 uF, +/- 10%, 16 V, -55 to 125 degC, 0805 (2012 Metric), RoHS, Tape and Reel; Manufacturer: Murata; Part Number: GRM21BR61C106KE15L
C131 C132 = CMP-2008-02064-1: Manufacturer: Kemet; Part Number: C0402C225M9PAC7867
C135 = CMP-2008-02209-1: Part Number: C0402C473J8RACTU; Manufacturer: Kemet
C136 C137 = CMP-2008-04556-1: Part Number: GRM155R61A105KE15D; Manufacturer: Murata
C139 = CMP-2007-03385-1: Manufacturer: Murata; Part Number: GRM21BR60J226ME39L
C140 = CMP-2007-03226-1: Manufacturer: Murata; Part Number: GRM21BR60G476ME15L
C141 = CMP-2008-04561-4: Chip Capacitor, 220 nF, +/- 10%, 10 V, -55 to 85 degC, 0402 (1005 Metric), RoHS, Tape and Reel; Manufacturer: Basic Passives; PartNumber: GRM155R61A224KE19D; Case\/Package: 0402; Voltage Rating: 10 V; Type (Capacitors): X5R; Capacitance: 220 nF; Max Operating Temperature: 85 degC; Package Quantity: 1; RoHSCompliant: true; Height: 0.5 mm; Mounting Technology: Surface Mount; Case Code (Metric): 1005; ComponentLink2URL: http://search.murata.co.jp/Ceramy/image/img/A01X/G101/ENG/GRM155R61A224KE19-01.pdf; Case Code (Imperial): 0402; Length: 1 mm; Radiation Hardening: No; Tolerance: 10%; Pins: 2; ComponentLink1Description: Manufacturer URL; Voltage Rating (DC): 10 V; Width: 0.5 mm; REACH SVHC: No SVHC; ComponentLink1URL: http://www.murata.com/; Min Operating Temperature: -55 degC; DatasheetVersion: 03/2016; Mount: Surface Mount; PackageReference: 0402; Packaging: Tape and Reel; ComponentLink2Description: Datasheet; PackageDescription: 2-Pin Surface Mount Device, Body 1 x 0.5 mm
D1 = CMP-1183-00008-2: Silicon Schottky Diode, -55 to 85 degC, SOD323, Reel, Green; Manufacturer: Infineon; Green: TRUE; VR (max): 10Â V; IF (max): 3,000Â mA; VF (max): 370Â mV; CT (max): 35Â pF; Configuration: Single; PackageDescription: 3-Pin Small Outline Transistor Package, 1.25 x 2 mm Body, 0.65 mm Pitch; PartNumber: BAT60A; Mounting Technology: Surface Mount; PackageReference: SOT323; ComponentLink1Description: Manufacturer URL; Packing: Reel; ComponentLink3URL: http://www.infineon.com/dgdl/SOT323-Package_Overview.pdf?folderId=db3a30431936bc4b0119533e1dcb3c92&fileId=db3a30431936bc4b011953495f283cb1; ComponentLink2URL: http://www.infineon.com/dgdl/bat60aseries.pdf?folderId=db3a304313d846880113def5812204a1&fileId=db3a304313d846880113def70c9304a9; ComponentLink1URL: http://www.infineon.com/; ComponentLink2Description: Datasheet; ComponentLink3Description: Package Specification
FB9-FB11 = CMP-0686-00148-3: Chip Ferrite Bead for GHz Band General Use (Low DC Resistance Type), 120 Ohm, 1500 mA, -55 to 125 degC, 1 x 0.5 x 0.55 mm SMD, Tape and Reel; Manufacturer: Murata; Rated Current: 1500 mA; Impedance (at 100 MHz): 120 Ohm +/- 25%; DC Resistance: 0.095 Ohm Max.; ComponentLink3URL: http://www.murata.com/products/catalog/pdf/c31e.pdf; ComponentLink1URL: http://www.murata.com/; Packing: Tape and Reel; Operating Temperature Range: -55 to 125 degC; PackageReference: BLM15-2; ComponentLink2Description: Datasheet; PackageDescription: 2-Pin Chip, Body 1 x 0.5 mm; ComponentLink2URL: http://www.murata.com/products/catalog/pdf/c31e.pdf; Mounting Technology: Surface Mount; ComponentLink3Description: Package Specification; ComponentLink1Description: Manufacturer URL; PartNumber: BLM15EG121SN1D; DatasheetVersion: 08/2013
FB12 = CMP-0686-00148-3: Chip Ferrite Bead for GHz Band General Use (Low DC Resistance Type), 120 Ohm, 1500 mA, -55 to 125 degC, 1 x 0.5 x 0.55 mm SMD, Tape and Reel; PartNumber: BLM15EG121SN1D; Manufacturer: Murata; Rated Current: 1500 mA; Impedance (at 100 MHz): 120 Ohm +/- 25%; DC Resistance: 0.095 Ohm Max.; ComponentLink3URL: http://www.murata.com/products/catalog/pdf/c31e.pdf; ComponentLink1URL: http://www.murata.com/; Packing: Tape and Reel; Operating Temperature Range: -55 to 125 degC; PackageReference: BLM15-2; ComponentLink2Description: Datasheet; PackageDescription: 2-Pin Chip, Body 1 x 0.5 mm; ComponentLink2URL: http://www.murata.com/products/catalog/pdf/c31e.pdf; Mounting Technology: Surface Mount; ComponentLink3Description: Package Specification; ComponentLink1Description: Manufacturer URL; DatasheetVersion: 08/2013
J1 = CMP-2000-06900-1: Through Hole Right Angle DC Power Jack, 2.5 A, 2.5 mm Center Pin, 3 Position, -25 to 85 degC, RoHS, Bulk; Manufacturer: CUIInc.; Insulation Resistance: 100MOhms; Inside Contact Diameter: 2.5mm; Outside Contact Diameter: 6.5mm; Voltage Rating: 24V; Current Rating: 2.5A; Brand: CUI; Datasheet URL: http://www.cui.com/product/resource/pj-102b.pdf; Housing Material: PolybutyleneTerephthalate(PBT); Operating Temperature Range: -25Cto+85C; Package Reference: PJ-102B; Factory Pack Quantity: 280; RoHS: True; Contact Material: Copper; Datasheet Version: Rev. 1.03, 04/2016; Product: Jacks; Mounting Angle: Right; Mounting Style: ThroughHole; Flammability Rating: UL94V-0; Product Category: DCPowerConnectors; Contact Gender: Male; Termination Style: ThroughHole; Manufacturer URL: http://www.cui.com/; Mounting Technology: ThroughHole; Package Description: 3-Pin Through Hole Device, Body 14.4 x 9 mm, Height 11 mm; Contact Plating: Nickel; Packaging: Bulk; Connector Type: DCPowerJack
L1-L3 = CMP-1354-00022-1: WE-LQS SMD Power Inductor, L=2.2 µH; PartNumber: 74404032022; Manufacturer: Wuerth Elektronik; Inductance: 2.2 ÂµH; ComponentLink2URL: http://katalog.we-online.de/pbs/datasheet/74404032022.pdf; ComponentLink1URL: http://www.we-online.com; ComponentLink2Description: Datasheet; ComponentLink1Description: Manufacturer URL; PackageReference: WE-LQS 3015
L8 = Inductor: LTF5022T-1R2N4R2-LC; Supplier 1: Digi-Key
R51 = CMP-2002-07350-1: Manufacturer: Yageo / Phycomp; Part Number: RC0402FR-0710K2L
R52 = CMP-2002-07358-1: Manufacturer: Yageo / Phycomp; Part Number: RC0402FR-0710RL
R53 = CMP-2002-02719-1: Manufacturer: Yageo; Part Number: RT0402BRD072K26L
SW2 = CMP-10040-000011-1: SWITCH TACTILE SPST-NO 0.05A 16V; Manufacturer: C&K Components; Electromechanical Life: 100000Cycles; Contact Resistance: 500mΩ; Operating Force: 400gf; Current Rating: 50mA; Voltage Rating Dc: 16V; Device Class L2: Switches; Device Class L1: Electromechanical; ComponentLink2URL: https://www.ckswitches.com/media/1476/pts810.pdf; Digikey Description: SWITCH TACTILE SPST-NO 0.05A 16V; RoHS: TRUE; Temperature Range Low: -40°C; Temperature Range High: +85°C; Automotive: No; Category: Switch; ComponentLink2Description: Datasheet; Device Class L3: Tactile Switches; Mouser Description: Switch Tactile N.O. SPST Button J-Bend 0.05A 16VDC 100000Cycles 3.92N SMD T/R; Throw Configuration: SPST-NO; Package: PTS810 SJG 250 SMTR LFS; Height: 2.7mm; Octopart: https://octopart.com/pts810sjg250smtrlfs-c%26k+components-29380277; Manufacturer Part Number: PTS810 SJG 250 SMTR LFS; Temperature: -40°C to +85°C; Lead Free: Yes
TP15-TP17 = TP
U5 = CMP-1518-00015-2: 1.2 A, Single-Chip PMIC for Battery-Powered Systems for AM335x ZCZ, DDR3, -40 to 105 degC, 48-pin VQFN (RSL), Green (RoHS & no Sb/Br); Vin(Min)(V): 2.7; Regulated Outputs(#): 7; Iout(Max)(A): 1.2; Packing: Small Tape and Reel; Step-Down DC/DC Converter: 3; Eco-Plan: TRUE; Vin(Max)(V): 5.8; ComponentLink3URL: http://www.ti.com/lit/ds/symlink/tps65070.pdf; PartNumber: TPS65217CRSLT; ComponentLink1URL: http://www.ti.com/; PackageReference: RSL0048A; ComponentLink1Description: Manufacturer URL; ComponentLink2URL: http://www.ti.com/lit/ds/symlink/tps65217c.pdf; ComponentLink3Description: Package Specification; Mounting Technology: Surface Mount; PackageDescription: 48-Pin Plastic Flat Pack, Body 6 x 6 mm, Pitch 0.4 mm; DatasheetVersion: SLVSB64F; ComponentLink2Description: Datasheet; PackageVersion: 4207548/B, 06/2011
U8 = CMP-0069-00941-3: 1.5MHz/3MHz 3.0A Step-Down DC-DC Switching Regulator, 10-pin LLP, Pb-Free; Manufacturer: Texas Instruments; CompType: Switcher; PackageTopMarking: ZXYTT*2833X; PowerWise: N; PackageDescription: LLP, Plastic, Dual, 3 x 3 x 0.8mm Body, 10 Lead, 0.5mm Pitch, No Pullback; ComponentLink1URL: http://www.ti.com/general/docs/lit/getliterature.tsp?genericPartNumber=LM2833&fileType=pdf; PinCount: 10; ComponentLink1Description: Datasheet URL; PackageReference: DSC0010A; RoHS: Y
U9 = CMP-0394-01514-2: Single Output LDO, 200 mA, Fixed 1.8 V Output, 2 to 5.5 V Input, with Low IQ, 6-pin WSON (DSE), -40 to 125 degC, Green (RoHS & no Sb/Br); Manufacturer: Texas Instruments; Fixed Output Options(V): 1.8; Iq(Typ)(mA): 0.03; Vin(Min)(V): 2; Iout(Max)(A): 0.2; Vin(Max)(V): 5.5; SubFamily: Single Channel LDO; Vdo(Typ)(mV): 175; ComponentLink3Description: Package Specification; ComponentLink2URL: http://www.ti.com/general/docs/lit/getliterature.tsp?genericPartNumber=TLV70018&fileType=pdf; PackageReference: DSE0006A; PartNumber: TLV70018DSET; PackageDescription: 6-Pin Plastic Small Outline, Body 1.5 x 1.5 mm, Pitch 0.5 mm; ComponentLink2Description: Datasheet; ComponentLink3URL: http://www.ti.com/litv/pdf/mpds287; Eco-Plan: Green (RoHS & no Sb/Br); Vout Adj(Max)(V): 1.8; DatasheetVersion: SLVSA00D; Accuracy(%): 2; PackageVersion: 4207810/A; ComponentLink1Description: Manufacturer URL; Vout Adj(Min)(V): 1.8; ComponentLink1URL: http://www.ti.com/; Mounting Technology: Surface Mount

## Sheet 10. eMMC.SchDoc
size A3
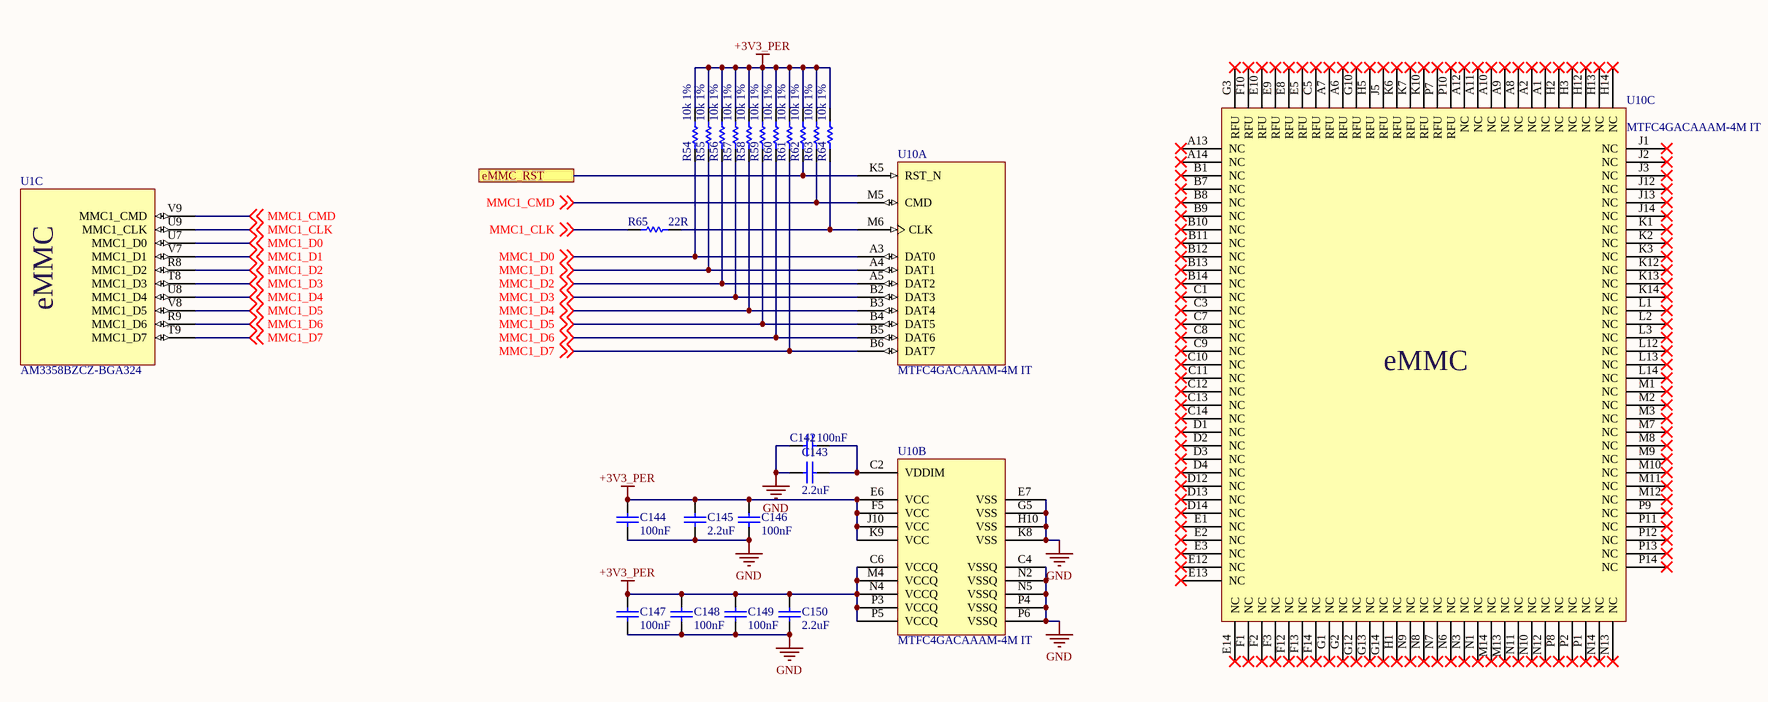
[diagram p7: 10. eMMC.SchDoc]

### Parts
C142  100nF  [CAPC1005X60X30LL05T10]
C143  2.2uF  [CAPC1608X90X35ML10T15]
C144  100nF  [CAPC1005X60X30LL05T10]
C145  2.2uF  [CAPC1005X60X30LL05T10]
C146  100nF  [CAPC1005X60X30LL05T10]
C147  100nF  [CAPC1005X60X30LL05T10]
C148  100nF  [CAPC1005X60X30LL05T10]
C149  100nF  [CAPC1005X60X30LL05T10]
C150  2.2uF  [CAPC1608X90X35ML10T15]
R54  10k 1%  [RESC1005X40X25LL05T05]
R55  10k 1%  [RESC1005X40X25LL05T05]
R56  10k 1%  [RESC1005X40X25LL05T05]
R57  10k 1%  [RESC1005X40X25LL05T05]
R58  10k 1%  [RESC1005X40X25LL05T05]
R59  10k 1%  [RESC1005X40X25LL05T05]
R60  10k 1%  [RESC1005X40X25LL05T05]
R61  10k 1%  [RESC1005X40X25LL05T05]
R62  10k 1%  [RESC1005X40X25LL05T05]
R63  10k 1%  [RESC1005X40X25LL05T05]
R64  10k 1%  [RESC1005X40X25LL05T05]
R65  22R  [RESC1005X40X25LL05T05]
U1  AM3358BZCZ-BGA324  [TI-ZCZ324]  (part C of 11)
U10  MTFC4GACAAAM-4M IT  [VFBGA-153]  (parts A,B,C of 3)

### Ports
eMMC_RST

### Nets
+3V3_PER: C144.2 C145.2 C146.2 C147.2 C148.2 C149.2 C150.2 R54.2 R55.2 R56.2 R57.2 R58.2 R59.2 R60.2 R61.2 R62.2 R63.2 R64.2 U10.C6(VCCQ) U10.E6(VCC) U10.F5(VCC) U10.J10(VCC) U10.K9(VCC) U10.M4(VCCQ) U10.N4(VCCQ) U10.P3(VCCQ) U10.P5(VCCQ)
GND: C142.2 C143.2 C144.1 C145.1 C146.1 C147.1 C148.1 C149.1 C150.1 U10.C4(VSSQ) U10.E7(VSS) U10.G5(VSS) U10.H10(VSS) U10.K8(VSS) U10.N2(VSSQ) U10.N5(VSSQ) U10.P4(VSSQ) U10.P6(VSSQ)
MMC1_CLK: R65.1 U1.U9(MMC1_CLK) ; off-sheet MMC1_CLK
MMC1_CMD: R63.1 U1.V9(MMC1_CMD) U10.M5(CMD) ; off-sheet MMC1_CMD
MMC1_D0: R54.1 U1.U7(MMC1_D0) U10.A3(DAT0) ; off-sheet MMC1_D0
MMC1_D1: R55.1 U1.V7(MMC1_D1) U10.A4(DAT1) ; off-sheet MMC1_D1
MMC1_D2: R56.1 U1.R8(MMC1_D2) U10.A5(DAT2) ; off-sheet MMC1_D2
MMC1_D3: R57.1 U1.T8(MMC1_D3) U10.B2(DAT3) ; off-sheet MMC1_D3
MMC1_D4: R58.1 U1.U8(MMC1_D4) U10.B3(DAT4) ; off-sheet MMC1_D4
MMC1_D5: R59.1 U1.V8(MMC1_D5) U10.B4(DAT5) ; off-sheet MMC1_D5
MMC1_D6: R60.1 U1.R9(MMC1_D6) U10.B5(DAT6) ; off-sheet MMC1_D6
MMC1_D7: R61.1 U1.T9(MMC1_D7) U10.B6(DAT7) ; off-sheet MMC1_D7
NetC142_1: C142.1 C143.1 U10.C2(VDDIM)
NetR62_1: R62.1 U10.K5(RST_N) ; port eMMC_RST
NetR64_1: R64.1 R65.2 U10.M6(CLK)

Not connected (* = marked no-connect by the designer): U10 A1(NC)* A2(NC)* A6(RFU)* A7(RFU)* A8(NC)* A9(NC)* A10(NC)* A11(NC)* A12(NC)* A13(NC)* A14(NC)* B1(NC)* B7(NC)* B8(NC)* B9(NC)* B10(NC)* B11(NC)* B12(NC)* B13(NC)* B14(NC)* C1(NC)* C3(NC)* C5(RFU)* C7(NC)* C8(NC)* C9(NC)* C10(NC)* C11(NC)* C12(NC)* C13(NC)* C14(NC)* D1(NC)* D2(NC)* D3(NC)* D4(NC)* D12(NC)* D13(NC)* D14(NC)* E1(NC)* E2(NC)* E3(NC)* E5(RFU)* E8(RFU)* E9(RFU)* E10(RFU)* E12(NC)* E13(NC)* E14(NC)* F1(NC)* F2(NC)* F3(NC)* F10(RFU)* F12(NC)* F13(NC)* F14(NC)* G1(NC)* G2(NC)* G3(RFU)* G10(RFU)* G12(NC)* G13(NC)* G14(NC)* H1(NC)* H2(NC)* H3(NC)* H5(RFU)* H12(NC)* H13(NC)* H14(NC)* J1(NC)* J2(NC)* J3(NC)* J5(RFU)* J12(NC)* J13(NC)* J14(NC)* K1(NC)* K2(NC)* K3(NC)* K6(RFU)* K7(RFU)* K10(RFU)* K12(NC)* K13(NC)* K14(NC)* L1(NC)* L2(NC)* L3(NC)* L12(NC)* L13(NC)* L14(NC)* M1(NC)* M2(NC)* M3(NC)* M7(NC)* M8(NC)* M9(NC)* M10(NC)* M11(NC)* M12(NC)* M13(NC)* M14(NC)* N1(NC)* N3(NC)* N6(NC)* N7(NC)* N8(NC)* N9(NC)* N10(NC)* N11(NC)* N12(NC)* N13(NC)* N14(NC)* P1(NC)* P2(NC)* P7(RFU)* P8(NC)* P9(NC)* P10(RFU)* P11(NC)* P12(NC)* P13(NC)* P14(NC)*

### Notes on the sheet
- Title
- Size:
- Date:
- A4
- Number:
- Time:
- Revision:
- Sheet
- of
- N.S.T
- Design by:
- Check by:
- https://github.com/tung080827
- (in symbol AM3358BZCZ100, part C) eMMC
- (in symbol CMP-2000-05234-1, part C) eMMC

### Library data of the parts
C142 C144 C146-C149 = CMP-2100-03641-1: as C73 on sheet 08. PMIC; REACH SVHC: NoSVHC; Depth: 0.5mm; Case/Package: 0402; Datasheet URL: http://psearch.en.murata.com/capacitor/product/GRM155R71C104KA88%23.pdf; Lead Free: LeadFree; Dielectric Material: Ceramic; Manufacturer URL: http://www.murata.com/; Min Operating Temperature: -55degC; Length: 1mm; Case Code (Metric): 1005; Radiation Hardening: No; Package Reference: 0402; RoHSCompliant: true; Datasheet Version: 42675.0; Thickness: 0.022inch; Packaging: TapeandReel; Voltage Rating (DC): 16V; Tolerance: 10%; Max Operating Temperature: 125degC; Package Description: 2-Pin Surface Mount Device, Body 1 x 0.5 mm; Mount: SurfaceMount; Height: 0.5mm; Width: 0.5mm; Number of Pins: 2; Voltage Rating: 16V; Case Code (Imperial): 0402; Termination: SMD/SMT; Capacitance: 100nF; Package Quantity: 1
C143 C145 C150 = CMP-2006-02836-1: CAP 2.2uF 10V ±10% 0603 (1608 Metric) Thickness 0.6mm SMD; Manufacturer: Murata; Part Number: GRM188R71A225KE15D
R54-R64 = CMP-2002-08135-1: 10k 0.063W 1% 0402 (1005 Metric)  SMD; Manufacturer: Vishay Dale; Part Number: CRCW040210K0FKED
R65 = CMP-1665-00027-3: Chip Resistor, 22 Ohm, +/- 1%, 0.1 W, -55 to 155 degC, 0402 (1005 Metric), RoHS, Tape and Reel; PartNumber: ERJ-2RKF22R0X; Case\/Package: 0402; Resistance: 22 Ohm; Power Rating: 100 mW; Voltage Rating: 50 V; ComponentLink2Description: Datasheet; Packaging: Tape and Reel; Weight: 2.8E-05oz; Pins: 2; Case Code (Imperial): 0402; Width: 0.5 mm; ComponentLink2URL: http://industrial.panasonic.com/cdbs/www-data/pdf/RDA0000/AOA0000C86.pdf; Height: 0.35 mm; PackageReference: 0402; REACH SVHC: Yes; Min Operating Temperature: -55 degC; Length: 1 mm; DatasheetVersion: 04/2015; RoHSCompliant: true; Package Quantity: 10000; Case Code (Metric): 1005; PackageDescription: 2-Pin Surface Mount Device, Body 1 x 0.5 mm; ComponentLink1URL: http://www.panasonic.com/; Mount: Surface Mount; Mounting Technology: Surface Mount; Tolerance: 1%; Max Operating Temperature: 155 degC; ComponentLink1Description: Manufacturer URL
U1 = AM3358BZCZ100: Sitara ARM Cortex-A8 32-Bit RISC Microprocessor, 1 GHz, SGX530 3D Graphics Engine, Programmable Real-Time Unit and Industrial Communication Subsystem (PRU-ICSS), 0 to 90 degC, 324-pin NFBGA (ZCZ), Green (RoHS & no Sb/Br); Supplier 1: Digi-Key
U10 = CMP-2000-05234-1: e·MMC Memory, 4 Gb, 2.7 to 3.6 V, -40 to 85 degC, 153-Ball VFBGA, RoHS; Manufacturer: Micron; Operating Supply Voltage: 3.3V; Max Processing Temp: 260; Lead Finish: Tin|Silver|Copper; Package Reference: VFBGA-153; Package Description: 153-Ball Very Fine Pitch Ball Grid Array, Body 13 x 11.5 mm, Pitch 0.5 mm; Datasheet Version: Rev. E, 06/2014; Operating Temperature: -40to85C; Mounting: SurfaceMount; Manufacturer URL: https://www.micron.com/; Package URL: http://download.siliconexpert.com/pdfs/2015/2/24/1/20/24/252/mic_/manual/emmc_ps8210_v451_80s_153b_it.pdf; Datasheet URL: http://download.siliconexpert.com/pdfs/2015/2/24/1/20/24/252/mic_/manual/emmc_ps8210_v451_80s_153b_it.pdf